# EAGLE design sketchy_060306_produced (EAGLE 4.15)
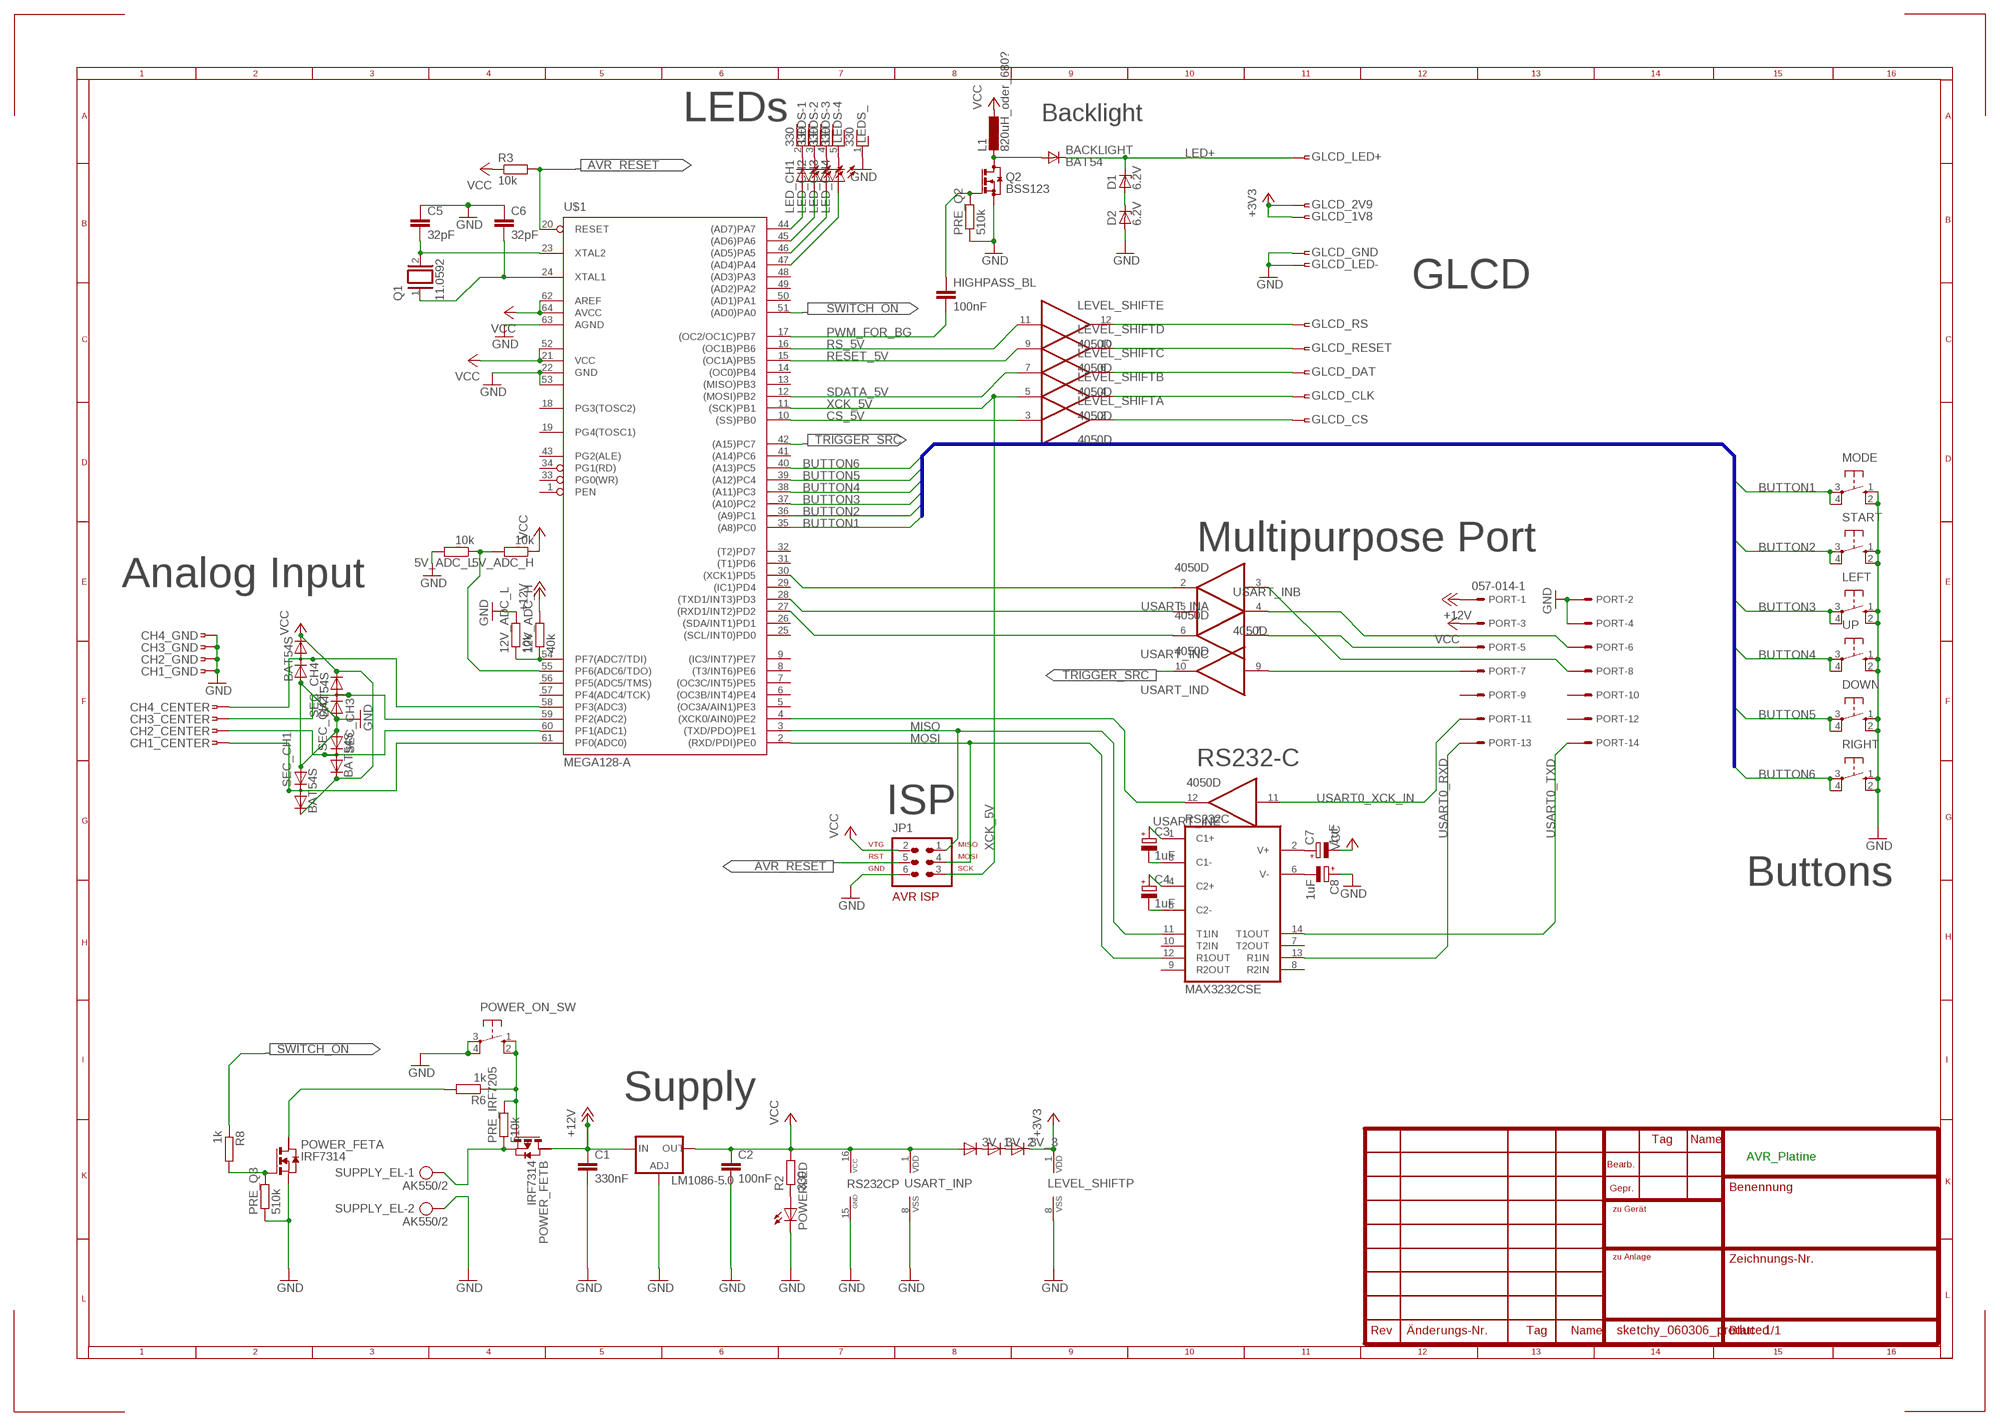
[diagram p0: schematic, sheet 1]

## Parts
3V_1  DIODE-MINIMELF  [MINIMELF]
3V_2  DIODE-MINIMELF  [MINIMELF]
3V_3  DIODE-MINIMELF  [MINIMELF]
5V_ADC_H  10k  R-EU_M0805  [M0805]
5V_ADC_L  10k  R-EU_M0805  [M0805]
12V_ADC_H  40k  R-EU_M0805  [M0805]
12V_ADC_L  10k  R-EU_M0805  [M0805]
BACKLIGHT  BAT54  DSOT23  [SOT-23]
C1  330nF  C-EU050-025X075  [C050-025X075]
C2  100nF  C-EU050-025X075  [C050-025X075]
C3  1uF  CPOL-EU153CLV-0405  [153CLV-0405]
C4  1uF  CPOL-EU153CLV-0405  [153CLV-0405]
C5  32pF  C-EUC0805  [C0805]
C6  32pF  C-EUC0805  [C0805]
C7  1uF  CPOL-EU153CLV-0405  [153CLV-0405]
C8  1uF  CPOL-EU153CLV-0405  [153CLV-0405]
CH1  BNC_GEWINKELT  [BNC]
CH2  BNC_GEWINKELT  [BNC]
CH3  BNC_GEWINKELT  [BNC]
CH4  BNC_GEWINKELT  [BNC]
D1  6.2V  ZENER-DIODESOT23  [SOT23]
D2  6.2V  ZENER-DIODESOT23  [SOT23]
DOWN  10-XX  [B3F-10XX]
GLCD  GLCD_S65  [GLCD_S65]
HIGHPASS_BL  100nF  C-EU050-025X075  [C050-025X075]
JP1  AVR-ISP-6  [AVR-ISP-6]
L1  820uH_oder_680?  L-EU2200-12.7  [2200-12.7]
LED_CH1  LEDCHIPLED_0805  [CHIPLED_0805]
LED_CH2  LEDCHIPLED_0805  [CHIPLED_0805]
LED_CH3  LEDCHIPLED_0805  [CHIPLED_0805]
LED_CH4  LEDCHIPLED_0805  [CHIPLED_0805]
LEDS  330  RNX4  [RN-5]
LEFT  10-XX  [B3F-10XX]
LEVEL_SHIFT  4050D  [SO16]
LM1086-5.0  LM317TL  [317TL]
MODE  10-XX  [B3F-10XX]
PORT  057-014-1  [057-014-1]
POWER_FET  IRF7314  PN_MOSFET-SO8  [SO8]
POWER_ON_SW  10-XX  [B3F-10XX]
POWERLED  LEDCHIPLED_0805  [CHIPLED_0805]
PRE_IRF7205  510k  R-EU_M0805  [M0805]
PRE_Q2  510k  R-EU_M0805  [M0805]
PRE_Q3  510k  R-EU_M0805  [M0805]
Q1  11.0592  XTAL/S  [QS]
Q2  BSS123  [SOT23]
R2  330  R-EU_M0805  [M0805]
R3  10k  R-EU_M0805  [M0805]
R6  1k  R-EU_M0805  [M0805]
R8  1k  R-EU_M0805  [M0805]
RIGHT  10-XX  [B3F-10XX]
RS232C  MAX3232CSE  [SO16]
SEC_CH1  BAT54S  DIODE_2CACA-SOT23  [SOT23]
SEC_CH2  BAT54S  DIODE_2CACA-SOT23  [SOT23]
SEC_CH3  BAT54S  DIODE_2CACA-SOT23  [SOT23]
SEC_CH4  BAT54S  DIODE_2CACA-SOT23  [SOT23]
START  10-XX  [B3F-10XX]
SUPPLY_EL  AK550/2  [AK550/2]
U$1  MEGA128-A  [TQFP64]
UP  10-XX  [B3F-10XX]
USART_IN  4050D  [SO16]

## Nets
+3V3: 3V_3.C GLCD.6 GLCD.8 LEVEL_SHIFT.1(P:VDD)
+12V: 12V_ADC_H.2 C1.1 LM1086-5.0.3(IN) PORT.1 POWER_FET.5(B:D)
AVR_RESET: JP1.5 R3.2 U$1.20(RESET)
BUTTON1: MODE.3(P) MODE.4(P1) U$1.35((A8)PC0)
BUTTON2: START.3(P) START.4(P1) U$1.36((A9)PC1)
BUTTON3: LEFT.3(P) LEFT.4(P1) U$1.37((A10)PC2)
BUTTON4: U$1.38((A11)PC3) UP.3(P) UP.4(P1)
BUTTON5: DOWN.3(P) DOWN.4(P1) U$1.39((A12)PC4)
BUTTON6: RIGHT.3(P) RIGHT.4(P1) U$1.40((A13)PC5)
CS_5V: LEVEL_SHIFT.3(A:I) U$1.10((SS)PB0)
GND: 5V_ADC_L.2 12V_ADC_L.2 C1.2 C2.2 C5.1 C6.1 C8.+ CH1.GND CH2.GND CH3.GND CH4.GND D2.1(A) DOWN.1(S) DOWN.2(S1) GLCD.7 GLCD.10 JP1.6 LEDS.1 LEFT.1(S) LEFT.2(S1) LEVEL_SHIFT.8(P:VSS) LM1086-5.0.1(ADJ) MODE.1(S) MODE.2(S1) PORT.2 PORT.4 POWER_FET.1(A:S) POWER_ON_SW.3(P) POWER_ON_SW.4(P1) POWERLED.C PRE_Q2.1 PRE_Q3.1 Q2.2(S) RIGHT.1(S) RIGHT.2(S1) RS232C.15(GND) SEC_CH1.1(A) SEC_CH2.1(A) SEC_CH3.1(A) SEC_CH4.1(A) START.1(S) START.2(S1) SUPPLY_EL.2 U$1.22(GND) U$1.53(GND1) U$1.63(AGND) UP.1(S) UP.2(S1) USART_IN.8(P:VSS)
LED+: BACKLIGHT.1(C) D1.3(C) GLCD.9
MISO: JP1.1 RS232C.11(T1IN) U$1.3((TXD/PDO)PE1)
MOSI: JP1.4 RS232C.12(R1OUT) U$1.2((RXD/PDI)PE0)
N$2: 12V_ADC_H.1 12V_ADC_L.1 U$1.54(PF7(ADC7/TDI))
N$3: BACKLIGHT.3(A) L1.2 Q2.3(D)
N$4: POWERLED.A R2.1
N$5: D1.1(A) D2.3(C)
N$6: 3V_1.C 3V_2.A
N$7: 3V_2.C 3V_3.A
N$8: POWER_FET.2(A:G) PRE_Q3.2 R8.2
N$9: POWER_FET.4(B:G) POWER_ON_SW.1(S) POWER_ON_SW.2(S1) PRE_IRF7205.2 R6.1
N$10: C5.2 Q1.2 U$1.23(XTAL2)
N$11: C6.2 Q1.1 U$1.24(XTAL1)
N$12: POWER_FET.7(A:D) R6.2
N$13: U$1.30((XCK1)PD5) USART_IN.2(A:O)
N$15: POWER_FET.3(B:S) PRE_IRF7205.1 SUPPLY_EL.1
N$16: U$1.28((TXD1/INT3)PD3) USART_IN.5(B:I)
N$17: U$1.27((RXD1/INT2)PD2) USART_IN.6(C:O)
N$18: GLCD.1 LEVEL_SHIFT.12(E:O)
N$19: GLCD.2 LEVEL_SHIFT.10(D:O)
N$20: GLCD.3 LEVEL_SHIFT.2(A:O)
N$21: GLCD.4 LEVEL_SHIFT.4(B:O)
N$23: GLCD.5 LEVEL_SHIFT.6(C:O)
N$26: CH1.CENTER SEC_CH1.3(AC) U$1.61(PF0(ADC0))
N$27: CH2.CENTER SEC_CH2.3(AC) U$1.60(PF1(ADC1))
N$28: CH3.CENTER SEC_CH3.3(AC) U$1.59(PF2(ADC2))
N$29: CH4.CENTER SEC_CH4.3(AC) U$1.58(PF3(ADC3))
N$30: PORT.6 USART_IN.4(B:O)
N$32: PORT.5 USART_IN.7(C:I)
N$34: PORT.8 USART_IN.3(A:I)
N$35: PORT.7 USART_IN.9(D:I)
N$36: 5V_ADC_H.2 5V_ADC_L.1 U$1.55(PF6(ADC6/TDO))
N$37: LED_CH1.A U$1.44((AD7)PA7)
N$38: LED_CH2.A U$1.45((AD6)PA6)
N$39: LED_CH3.A U$1.46((AD5)PA5)
N$40: LED_CH4.A U$1.47((AD4)PA4)
N$41: LED_CH1.C LEDS.2
N$42: LED_CH2.C LEDS.3
N$43: LED_CH3.C LEDS.4
N$44: LED_CH4.C LEDS.5
N$45: C3.+ RS232C.1(C1+)
N$46: C3.- RS232C.3(C1-)
N$47: C4.+ RS232C.4(C2+)
N$48: C4.- RS232C.5(C2-)
N$49: C7.+ RS232C.2(V+)
N$50: C8.- RS232C.6(V-)
N$51: HIGHPASS_BL.1 PRE_Q2.2 Q2.1(G)
N$54: U$1.4((XCK0/AIN0)PE2) USART_IN.12(E:O)
PWM_FOR_BG: HIGHPASS_BL.2 U$1.17((OC2/OC1C)PB7)
RESET_5V: LEVEL_SHIFT.9(D:I) U$1.15((OC1A)PB5)
RS_5V: LEVEL_SHIFT.11(E:I) U$1.16((OC1B)PB6)
SDATA_5V: LEVEL_SHIFT.7(C:I) U$1.12((MOSI)PB2)
SWITCH_ON: R8.1 U$1.51((AD0)PA0)
TRIGGER_SRC: U$1.42((A15)PC7) USART_IN.10(D:O)
USART0_RXD: PORT.13 RS232C.13(R1IN)
USART0_TXD: PORT.14 RS232C.14(T1OUT)
USART0_XCK_IN: PORT.11 USART_IN.11(E:I)
VCC: 3V_1.A 5V_ADC_H.1 C2.1 C7.- JP1.2 L1.1 LM1086-5.0.2(OUT) PORT.3 R2.2 R3.1 RS232C.16(VCC) SEC_CH1.2(C) SEC_CH2.2(C) SEC_CH3.2(C) SEC_CH4.2(C) U$1.21(VCC) U$1.52(VCC1) U$1.62(AREF) U$1.64(AVCC) USART_IN.1(P:VDD)
XCK_5V: JP1.3 LEVEL_SHIFT.5(B:I) U$1.11((SCK)PB1)
Unconnected: LEVEL_SHIFT.14(F:I) LEVEL_SHIFT.15(F:O) PORT.9 PORT.10 PORT.12 POWER_FET.6(B:D2) POWER_FET.8(A:D2) RS232C.7(T2OUT) RS232C.8(R2IN) RS232C.9(R2OUT) RS232C.10(T2IN) U$1.1(PEN) U$1.5((OC3A/AIN1)PE3) U$1.6((OC3B/INT4)PE4) U$1.7((OC3C/INT5)PE5) U$1.8((T3/INT6)PE6) U$1.9((IC3/INT7)PE7) U$1.13((MISO)PB3) U$1.14((OC0)PB4) U$1.18(PG3(TOSC2)) U$1.19(PG4(TOSC1)) U$1.25((SCL/INT0)PD0) U$1.26((SDA/INT1)PD1) U$1.29((IC1)PD4) U$1.31((T1)PD6) U$1.32((T2)PD7) U$1.33(PG0(WR)) U$1.34(PG1(RD)) U$1.41((A14)PC6) U$1.43(PG2(ALE)) U$1.48((AD3)PA3) U$1.49((AD2)PA2) U$1.50((AD1)PA1) U$1.56(PF5(ADC5/TMS)) U$1.57(PF4(ADC4/TCK)) USART_IN.14(F:I) USART_IN.15(F:O)

## Buses
BUTTON[1..6]

## Notes on the sheet
- LEDs | Backlight
- GLCD
- Multipurpose Port
- Analog Input
- RS232-C
- ISP
- Buttons
- Supply
- AVR_Platine

## Library data of the parts
3V_1-3V_3 = diode:DIODE-: DIODE
5V_ADC_H 5V_ADC_L 12V_ADC_H 12V_ADC_L PRE_IRF7205 PRE_Q2 PRE_Q3 R2 R3 R6 R8 = rcl:R-EU_: RESISTOR, European symbol
BACKLIGHT = zetex:D: DIODE
C1 C2 C5 C6 HIGHPASS_BL = rcl:C-EU: CAPACITOR, European symbol
C3 C4 C7 C8 = rcl:CPOL-EU: POLARIZED CAPACITOR, European symbol
CH1-CH4 = zween:BNC_GEWINKELT
D1 D2 = diode:ZENER-DIODE: Z-Diode
DOWN LEFT MODE POWER_ON_SW RIGHT START UP = switch-omron:10-XX: OMRON SWITCH
GLCD = zween:GLCD_S65: package for GLCD from Siemens S65
JP1 = atmel:AVR-ISP-6: AVR ISP-6 Serial Programming Header
L1 = rcl:L-EU: INDUCTOR, European symbol
LED_CH1-LED_CH4 POWERLED = led:LED: LED OSRAM: - CHIPLED LG R971, LG N971, LY N971, LG Q971, LY Q971, LO R971, LY R971 LH N974, LH R974 LS Q976, LO Q976, LY Q976 LO Q996 - Hyper CHIPLED LW Q18S LB Q993, LB Q99A, LB R99A - SideLED LS A670, LO A670, LY A670, LG A670, LP A670 LB A673, LV A673, LT A673, LW A673 LH A674 LY A675 LS A676, LA A676, LO A676, LY A676, LW A676 LS A679, LY A679, LG A679 - Hyper Micro SIDELED® LS Y876, LA Y876, LO Y876, LY Y876 LT Y87S - SmartLED LW L88C, LW L88S LB L89C, LB L89S, LG L890 LS L89K, LO L89K, LY L89K LS L896, LA L896, LO L896, LY L896 - TOPLED LS T670, LO T670, LY T670, LG T670, LP T670 LSG T670, LSP T670, LSY T670, LOP T670, LYG T670 LG T671, LOG T671, LSG T671 LB T673, LV T673, LT T673, LW T673 LH T674 LS T676, LA T676, LO T676, LY T676, LB T676, LH T676, LSB T676, LW T676 LB T67C, LV T67C, LT T67C, LS T67K, LO T67K, LY T67K, LW E67C LS E67B, LA E67B, LO E67B, LY E67B, LB E67C, LV E67C, LT E67C LW T67C LS T679, LY T679, LG T679 LS T770, LO T770, LY T770, LG T770, LP T770 LB T773, LV T773, LT T773, LW T773 LH T774 LS E675, LA E675, LY E675, LS T675 LS T776, LA T776, LO T776, LY T776, LB T776 LHGB T686 LT T68C, LB T68C - Hyper Mini TOPLED® LB M676 - Mini TOPLED Santana® LG M470 LS M47K, LO M47K, LY M47K Source: http://www.osram.convergy.de/
LEDS = resistor-net:RNX4: RESISTOR NETWORK
LEVEL_SHIFT USART_IN = 40xx:4050: Hex non-inverting BUFFER
LM1086-5.0 = v-reg:LM317TL: VOLTAGE REGULATOR
PORT = con-panduit:057-014-: CONNECTOR 10-pin series 057 contact pc board low profile headers
POWER_FET = zetex:PN_MOSFET-: DUAL N AND P-CHANNEL ENHANCEMENT MODE MOSFET source ZXMD63C02.pdf from http://www.zetex.com/
Q1 = special:XTAL/S: CRYSTAL
Q2 = transistor-small-signal:BSS123: N-CHANNEL MOS FET
RS232C = maxim:MAX3232*: True RS-232 Transceivers 3.0V to 5.5V, Low-Power up to 1Mbps, Using Four 0.1µF External Capacitors Source: http://pdfserv.maxim-ic.com/en/ds/MAX3222-MAX3241.pdf
SEC_CH1-SEC_CH4 = diode:DIODE_2CACA-: 2 Diodes - Cathode-Anode|Cathode-Anode
SUPPLY_EL = con-ptr500:AK550/2: CONNECTOR
U$1 = avr:MEGA128: MICROCONTROLLER 128 Kbytes FLASH 4 Kbytes SRAM 4 Kbytes EEPROM DUAL USART 8-channel 10 bit ADC

## Net classes
1 motorsupply: width 1.016 mm, drill 1.016 mm

## Board
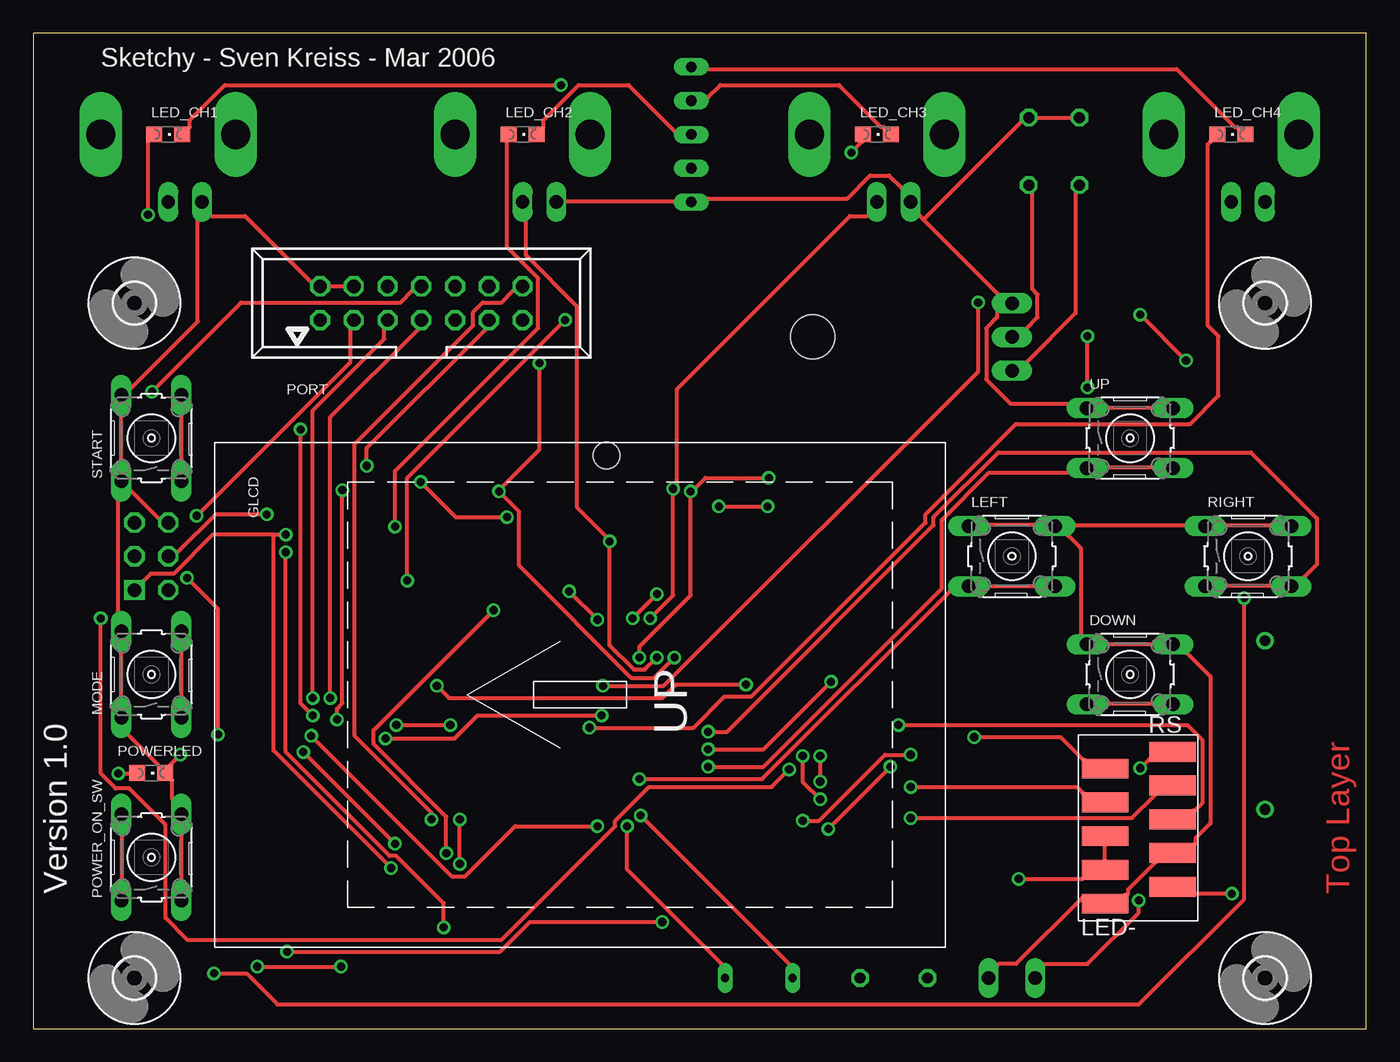
[diagram p1: board, top side]
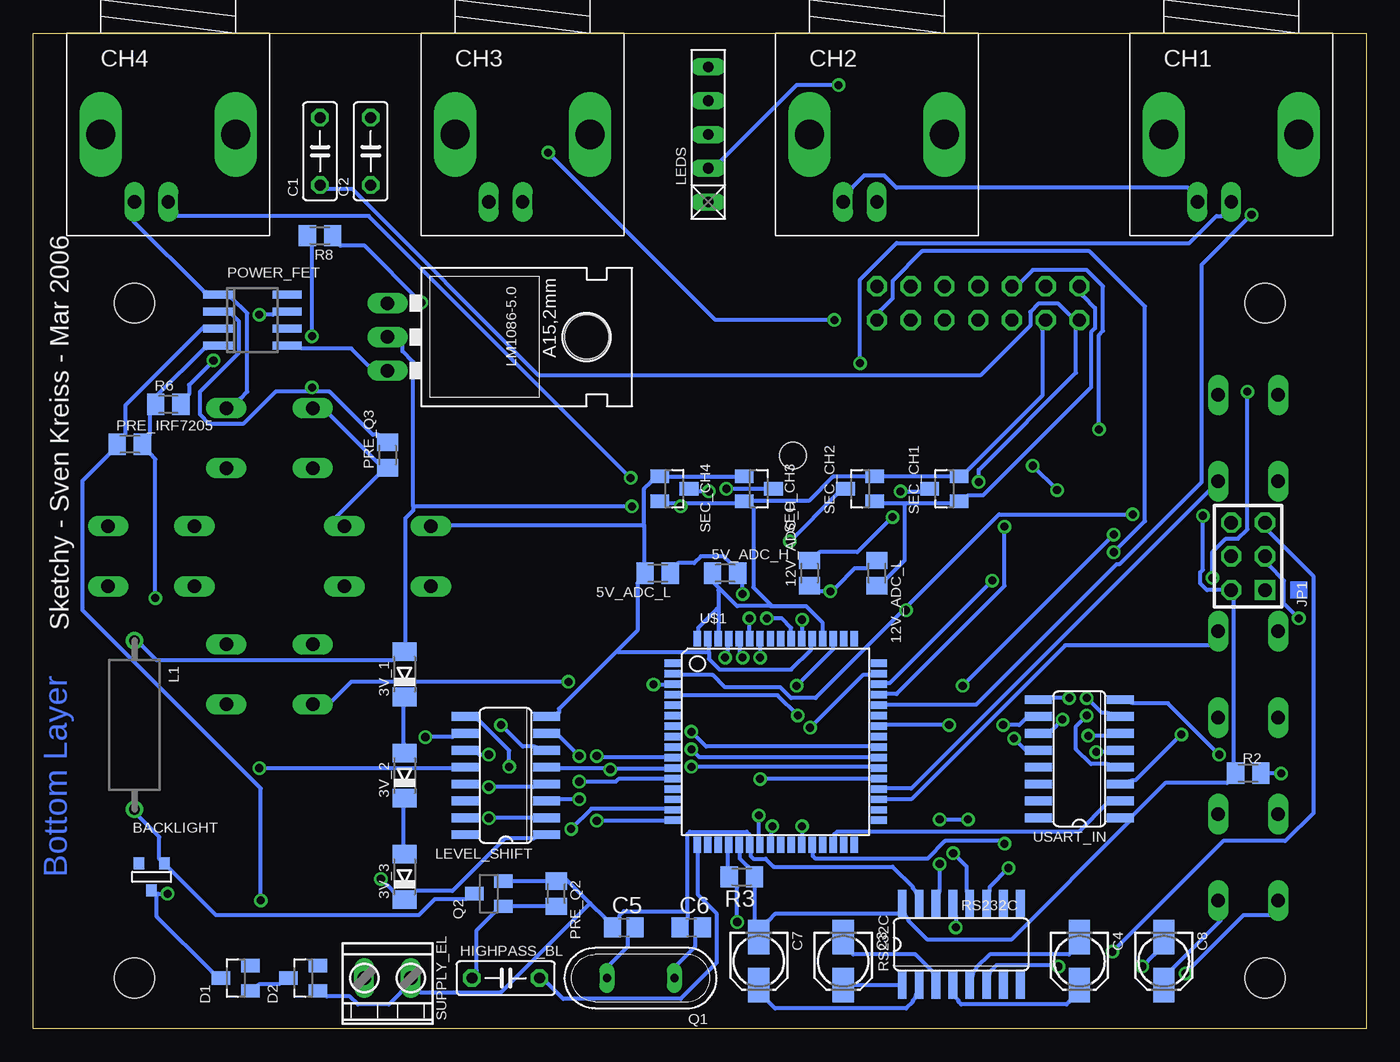
[diagram p2: board, bottom side, seen from below]

Size 100.33 x 74.93 mm. Coordinates in mm from the lower left corner, seen from the top.
Outline: 0,0 100.33,0 100.33,74.93 0,74.93 0,0
Copper layers (1*16): Top 0.035mm / dielectric 1.5mm / Bottom 0.035mm
Design rules "default": minimum track width 12mil, minimum drill 24mil, track to track 10mil, track to pad 10mil, pad to pad 8mil, via to via 10mil, smd to smd 8mil, copper to edge 40mil, drill to drill 10mil, minimum pad ring 10mil, minimum via ring 8mil, stop-mask expansion 4mil, vias tented up to drill 0mil, thermal gap 10mil

### Footprints (pad centres in the part's own frame; a part is rotated, then mirrored left to right if it is on the bottom)
MINIMELF = smd 1.4 x 1.8: A 1.7,0; C -1.7,0
M0805 = smd 1.3 x 1.6: 1 -0.95,0; 2 0.95,0
SOT-23 = smd 0.787 x 0.889: 1 0.025,-1.016; 2 -0.94,1.016; 3 0.991,1.016
C050-025X075 = drill 0.813 octagon: 1 -2.54,0; 2 2.54,0
153CLV-0405 = smd 2.6 x 1.6: + 1.8,0; - -1.8,0
C0805 = smd 1.3 x 1.5: 1 -0.85,0; 2 0.85,0
BNC = drill 1 long: CENTER 0,-5.08; GND -2.54,-5.08 | drill 2.2 long: P$1 -5.08,0; P$4 5.08,0
SOT23 = smd 1 x 1.4: 1 -0.95,-1.1; 2 0.95,-1.1; 3 0,1.1
B3F-10XX = drill 1.016 long: 1 -3.251,2.261; 2 3.251,2.261; 3 -3.251,-2.261; 4 3.251,-2.261
GLCD_S65 = smd 1.5 x 3.5: 1 3.285,12.08; 2 4.555,7; 3 5.825,12.08; 4 7.095,7; 5 8.365,12.08; 6 9.635,7; 7 10.905,12.08; 8 12.175,7; 9 13.445,12.08; 10 14.715,7 | hole 2: -19,-30.5
AVR-ISP-6 = drill 1.016 square: 1 -2.54,-1.27 | drill 1.016 octagon: 2 -2.54,1.27; 3 0,-1.27; 4 0,1.27; 5 2.54,-1.27; 6 2.54,1.27
2200-12.7 = drill 0.8 pad 1.27 round: 1 -6.35,0; 2 6.35,0
CHIPLED_0805 = smd 1.2 x 1.2: A 0,-1.05; C 0,1.05
RN-5 = drill 0.813 long: 1 -5.08,0; 2 -2.54,0; 3 0,0; 4 2.54,0; 5 5.08,0
SO16 = smd 0.66 x 2.032: 1 -4.445,-3.073; 2 -3.175,-3.073; 3 -1.905,-3.073; 4 -0.635,-3.073; 5 0.635,-3.073; 6 1.905,-3.073; 7 3.175,-3.073; 8 4.445,-3.073; 9 4.445,3.073; 10 3.175,3.073; 11 1.905,3.073; 12 0.635,3.073; 13 -0.635,3.073; 14 -1.905,3.073; 15 -3.175,3.073; 16 -4.445,3.073
317TL = drill 1.016 long: 1 -2.54,-3.81; 2 0,-3.81; 3 2.54,-3.81 | hole 3.302: 0,11.176
057-014-1 = drill 1 octagon: 1 -7.62,-1.27; 2 -7.62,1.27; 3 -5.08,-1.27; 4 -5.08,1.27; 5 -2.54,-1.27; 6 -2.54,1.27; 7 0,-1.27; 8 0,1.27; 9 2.54,-1.27; 10 2.54,1.27; 11 5.08,-1.27; 12 5.08,1.27; 13 7.62,-1.27; 14 7.62,1.27
SO8 = smd 0.6 x 2.2: 1 -1.905,-2.6; 2 -0.635,-2.6; 3 0.635,-2.6; 4 1.905,-2.6; 5 1.905,2.6; 6 0.635,2.6; 7 -0.635,2.6; 8 -1.905,2.6
QS = drill 0.61 long: 1 -2.54,0; 2 2.54,0
AK550/2 = drill 1 pad 1.5 long: 1 -1.75,0; 2 1.75,0
TQFP64 = smd 1.194 x 0.559: 1 -7.76,5.905; 2 -7.76,5.118; 3 -7.76,4.331; 4 -7.76,3.543; 5 -7.76,2.756; 6 -7.76,1.968; 7 -7.76,1.181; 8 -7.76,0.394; 9 -7.76,-0.394; 10 -7.76,-1.181; 11 -7.76,-1.968; 12 -7.76,-2.756; 13 -7.76,-3.543; 14 -7.76,-4.331; 15 -7.76,-5.118; 16 -7.76,-5.905; 33 7.76,-5.905; 34 7.76,-5.118; 35 7.76,-4.331; 36 7.76,-3.543; 37 7.76,-2.756; 38 7.76,-1.968; 39 7.76,-1.181; 40 7.76,-0.394; 41 7.76,0.394; 42 7.76,1.181; 43 7.76,1.968; 44 7.76,2.756; 45 7.76,3.543; 46 7.76,4.331; 47 7.76,5.118; 48 7.76,5.905 | smd 0.559 x 1.194: 17 -5.905,-7.76; 18 -5.118,-7.76; 19 -4.331,-7.76; 20 -3.543,-7.76; 21 -2.756,-7.76; 22 -1.968,-7.76; 23 -1.181,-7.76; 24 -0.394,-7.76; 25 0.394,-7.76; 26 1.181,-7.76; 27 1.968,-7.76; 28 2.756,-7.76; 29 3.543,-7.76; 30 4.331,-7.76; 31 5.118,-7.76; 32 5.905,-7.76; 49 5.905,7.76; 50 5.118,7.76; 51 4.331,7.76; 52 3.543,7.76; 53 2.756,7.76; 54 1.968,7.76; 55 1.181,7.76; 56 0.394,7.76; 57 -0.394,7.76; 58 -1.181,7.76; 59 -1.968,7.76; 60 -2.756,7.76; 61 -3.543,7.76; 62 -4.331,7.76; 63 -5.118,7.76; 64 -5.905,7.76
3,0 = hole 3: 0,0

### Placement (x,y rotation side)
3V_1  72.39,26.67 90 bottom
3V_2  72.39,19.05 90 bottom
3V_3  72.39,11.43 90 bottom
5V_ADC_H  48.26,34.29 0 bottom
5V_ADC_L  53.34,34.29 180 bottom
12V_ADC_H  41.91,34.29 90 bottom
12V_ADC_L  36.83,34.29 270 bottom
BACKLIGHT  91.44,11.43 0 bottom
C1  78.74,66.04 90 bottom
C2  74.93,66.04 90 bottom
C3  39.37,5.08 270 bottom
C4  21.59,5.08 270 bottom
C5  55.88,7.62 0 bottom
C6  50.8,7.62 0 bottom
C7  45.72,5.08 270 bottom
C8  15.24,5.08 270 bottom
CH1  10.16,67.31 0 bottom
CH2  36.83,67.31 0 bottom
CH3  63.5,67.31 0 bottom
CH4  90.17,67.31 0 bottom
D1  85.09,3.81 90 bottom
D2  80.01,3.81 90 bottom
DOWN  82.55,26.67 0 top
GLCD  73.66,24.13 270 top
HIGHPASS_BL  64.77,3.81 0 bottom
JP1  8.89,35.56 90 bottom
L1  92.71,22.86 270 bottom
LED_CH1  10.16,67.31 270 top
LED_CH2  36.83,67.31 270 top
LED_CH3  63.5,67.31 270 top
LED_CH4  90.17,67.31 270 top
LEDS  49.53,67.31 90 bottom
LEFT  73.66,35.56 0 top
LEVEL_SHIFT  64.77,19.05 90 bottom
LM1086-5.0  69.85,52.07 270 bottom
MODE  8.89,26.67 90 top
PORT  29.21,54.61 0 top
POWER_FET  83.82,53.34 270 bottom
POWER_ON_SW  8.89,12.89 90 top
POWERLED  8.89,19.24 270 top
PRE_IRF7205  93.06,43.99 0 bottom
PRE_Q2  60.96,10.16 270 bottom
PRE_Q3  73.66,43.18 90 bottom
Q1  54.61,3.81 180 bottom
Q2  66.04,10.16 90 bottom
R2  8.89,19.24 180 bottom
R3  46.99,11.43 180 bottom
R6  90.17,46.99 0 bottom
R8  78.74,59.69 180 bottom
RIGHT  91.44,35.56 0 top
RS232C  30.48,6.35 0 bottom
SEC_CH1  31.75,40.64 90 bottom
SEC_CH2  38.1,40.64 90 bottom
SEC_CH3  45.72,40.64 270 bottom
SEC_CH4  52.07,40.64 270 bottom
START  8.89,44.45 90 top
SUPPLY_EL  73.66,3.81 0 bottom
U$1  44.45,21.59 0 bottom
U$3  [3,0]  7.62,54.61 0 top
U$4  [3,0]  92.71,54.61 0 top
U$5  [3,0]  92.71,3.81 0 top
U$6  [3,0]  7.62,3.81 0 top
UP  82.55,44.45 0 top
USART_IN  21.59,20.32 90 bottom

### Tracks (layer width: path | path; a pad name or v marks a point on that pad's centre or on a via)
+3V3  (via drill 0.61)
  Top 0.305: GLCD.6 80.67,13.82 80.67,12.7 GLCD.8 78.94,11.28 v74.17,11.28
  Bottom 0.305: LEVEL_SHIFT.1 62.69,14.33 64.82,14.33 68.78,10.36 71.53,10.36 3V_3.C 73.25,10.36 v74.17,11.28
+12V  (via drill 0.61)
  Top 0.305: C1.1 78.44,62.89 78.44,53.85 74.78,50.19 LM1086-5.0.3 | v35.66,38.51 31.8,38.51 v29.16,41.15
  Bottom 0.305: POWER_FET.5 80.16,51.21 76.4,51.21 75.08,49.89 LM1086-5.0.3 | v35.66,38.51 38.3,35.87 41.15,35.87 12V_ADC_H.2 | v29.16,41.15 29.16,42.06 21.84,49.38 21.84,52.63 PORT.1 22.25,53.65 23.16,54.56 24.69,54.56 25.3,53.95 25.3,52.93 29.06,49.17 62.28,49.17 76.3,63.2 78.13,63.2 C1.1
AVR_RESET  (via drill 0.61)
  Top 0.305: v47.35,8.03 37.39,8.03 35.15,5.79 v19.1,5.79
  Bottom 0.305: U$1.20 48.06,13.31 48.06,12.19 R3.2 47.35,10.67 v47.35,8.03 | v19.1,5.79 10.77,14.12 6.1,14.12 3.96,16.26 3.96,34.04 7.32,37.39 JP1.5
BUTTON1
  Top 0.305: MODE.3 11.18,24.89 11.18,28.45 MODE.4
  Bottom 0.305: U$1.35 36.17,17.27 34.24,17.27 22.66,28.85 11.89,28.85 MODE.4
BUTTON2
  Top 0.305: START.4 11.18,46.23 11.18,42.67 START.3
  Bottom 0.305: U$1.36 36.17,18.09 34.24,18.09 11.89,40.44 START.3
BUTTON3  (via drill 0.61)
  Top 0.305: v45.62,18.8 54.86,18.8 68.99,32.92 LEFT.3 71.83,33.33 75.49,33.33 LEFT.4
  Bottom 0.305: v45.62,18.8 37.19,18.8 U$1.37
BUTTON4  (via drill 0.61)
  Top 0.305: v50.8,19.71 54.97,19.71 68.38,33.12 68.38,38.3 71.93,41.86 77.83,41.86 UP.3 80.77,42.27 84.33,42.27 UP.4
  Bottom 0.305: v50.8,19.71 37.19,19.71 U$1.38
BUTTON5  (via drill 0.61)
  Top 0.305: v50.8,21.03 54.97,21.03 v60.05,26.11 | DOWN.4 84.33,24.49 80.77,24.49 DOWN.3
  Bottom 0.305: v50.8,21.03 50.19,20.42 37.19,20.42 U$1.39 | v60.05,26.11 76.4,26.11 77.83,24.69 DOWN.3
BUTTON6  (via drill 0.61)
  Top 0.305: v50.8,22.35 52.22,22.35 67.77,37.9 67.77,38.51 72.64,43.38 91.64,43.38 96.62,38.41 96.62,34.95 95.71,34.04 RIGHT.4 93.27,33.33 89.61,33.33 RIGHT.3
  Bottom 0.305: v50.8,22.35 49.68,21.23 37.19,21.23 U$1.40
CS_5V  (via drill 0.61)
  Top 0.305: v57.91,20.52 57.91,18.59 v59.23,17.27
  Bottom 0.305: v57.91,20.52 57.81,20.42 52.73,20.42 U$1.10 | v59.23,17.27 60.76,17.27 LEVEL_SHIFT.3
GND  (via drill 0.61)
  Top 0.305: PORT.4 PORT.2 20.93,56.19 15.95,61.16 13.41,61.16 CH1.GND 12.39,60.76 12.39,53.24 7.32,48.16 START.2 6.6,46.23 6.6,42.67 START.1 | JP1.6 9.45,38.41 7.32,40.54 START.1 | POWERLED.C 10.46,18.69 10.46,17.27 POWER_ON_SW.4 11.18,14.63 11.18,11.07 POWER_ON_SW.3 | v11.07,20.62 10.26,19.81 POWERLED.C | POWERLED.C 9.45,19.81 7.11,22.15 MODE.1 6.6,24.89 6.6,28.45 MODE.2 6.4,31.39 6.4,39.73 START.1 | SUPPLY_EL.2 72.64,4.88 73.97,4.88 78.94,9.86 GLCD.10 82.4,10.16 82.4,10.46 84.43,12.5 GLCD.7 87.48,13.92 87.48,14.33 88.59,15.44 88.59,26.52 86.87,28.25 DOWN.2 84.33,28.96 80.77,28.96 DOWN.1 78.84,29.67 78.84,36.17 77.93,37.08 LEFT.2 | CH2.GND 40.03,62.28 48.26,62.28 LEDS.1 50.8,62.48 61.27,62.48 62.99,64.21 64.41,64.21 65.33,63.3 CH3.GND 66.75,61.16 67,60.91 | C1.2 C2.2 74.37,68.28 67,60.91 | 67,60.91 72.64,55.27 LM1086-5.0.1 72.54,53.95 72.54,53.54 71.73,52.73 71.73,48.87 73.56,47.04 77.83,47.04 UP.1 80.77,46.74 84.33,46.74 UP.2 | RIGHT.2 93.27,37.9 89.61,37.9 RIGHT.1 86.77,37.9 78.33,37.9 LEFT.2 | LEFT.1 71.83,37.9 75.49,37.9 LEFT.2
  Bottom 0.305: 34.75,39.52 36.37,39.52 SEC_CH2.1 | 34.75,39.52 31.29,39.52 SEC_CH1.1 29.97,40.13 28.85,40.13 20.73,48.26 20.73,52.43 20.42,52.73 20.42,54.25 21.34,55.17 PORT.2 | 12V_ADC_L.2 36.07,33.93 34.75,35.26 34.75,39.52 | C8.+ 14.53,4.57 10.97,8.13 POWER_ON_SW.3 | v11.07,20.62 14.94,24.49 17.58,24.49 USART_IN.8 | D2.1 78.23,2.44 76.5,2.44 75.89,1.83 73.56,1.83 72.64,2.74 SUPPLY_EL.2 71.22,2.74 65.13,2.74 58.42,9.45 | Q2.2 64.31,11.07 61.67,11.07 PRE_Q2.1 60.25,11.28 58.42,9.45 | 58.42,9.45 57.3,8.33 C5.1 56.19,8.33 56.19,8.53 55.88,8.84 51.1,8.84 | 51.1,8.84 51.1,8.33 C6.1 | 51.1,8.84 51.1,14.63 50.9,14.83 46.63,14.83 46.43,14.63 46.43,14.33 U$1.22 46.33,13.31 46.33,13.01 46.13,12.8 45.21,12.8 44.6,12.19 35.66,12.19 34.14,10.67 34.14,10.57 33.93,10.36 RS232C.15 | 49.48,28.35 49.48,28.85 U$1.63 | 49.48,28.35 49.48,27.84 48.67,27.03 43.28,27.03 41.76,28.55 41.76,28.85 U$1.53 | SEC_CH3.1 47.45,41.55 52.53,41.55 SEC_CH4.1 53.85,41.15 54.36,40.64 54.36,37.9 | 54.36,37.9 54.36,35.05 5V_ADC_L.2 54.86,33.53 54.86,29.97 56.39,28.45 | 56.39,28.45 60.76,24.08 60.76,23.77 LEVEL_SHIFT.8 | 49.48,28.35 56.29,28.35 56.39,28.45 | CH4.GND 92.76,60.76 87.48,55.47 POWER_FET.1 85.34,54.97 84.23,53.85 84.23,47.95 84.73,47.45 UP.2 | LEFT.2 77.52,38.51 74.37,41.66 PRE_Q3.1 74.37,42.57 78.03,46.23 UP.1 | 54.36,37.9 68.99,37.9 LEFT.1 | CH1.GND 13.41,63.3 35.36,63.3 36.27,64.21 37.8,64.21 38.71,63.3 CH2.GND
LED+  (via drill 0.61)
  Top 0.305: v90.22,10.16 87.48,10.16 GLCD.9
  Bottom 0.305: 91.03,10.06 91.03,8.43 86.87,4.27 D1.3 | 91.03,10.06 BACKLIGHT.1 | v90.22,10.16 90.93,10.16 91.03,10.06
MISO  (via drill 0.61)
  Top 0.305: v53.65,25.91 48.36,25.91 47.35,24.89 31.29,24.89 v30.38,25.81 | 18.09,37.19 13.51,37.19 10.57,34.24 8.84,34.24 JP1.1 | 18.09,37.19 v19,37.19 | v26.92,12.09 18.09,20.93 18.09,37.19
  Bottom 0.305: v53.65,25.91 52.73,25.91 U$1.3 | v19,37.19 v30.38,25.81 | v26.92,12.09 28.35,10.67 28.35,10.36 RS232C.11
MOSI  (via drill 0.61)
  Top 0.305: v17.58,38.71 13.72,38.71 10.87,35.87 JP1.4 | v31.09,13.21 31.09,15.95 25.6,21.44 25.6,22.45 v34.65,31.5
  Bottom 0.305: 34.75,31.6 27.64,38.71 v17.58,38.71 | 34.75,31.6 41.45,24.89 43.28,24.89 44.09,25.7 48.26,25.7 49.17,26.62 51.71,26.62 U$1.2 | v31.09,13.21 30.07,12.19 30.07,10.36 RS232C.12 | v34.65,31.5 34.75,31.6
N$2  (via drill 0.61)
  Top 0.305: v40.34,32.92 v42.47,30.79
  Bottom 0.305: v42.47,30.79 42.47,29.87 U$1.54 | 12V_ADC_H.1 41.15,32.92 v40.34,32.92 39.93,33.22 38.51,34.65 37.59,34.65 12V_ADC_L.1
N$3
  Bottom 0.305: L1.2 92.35,15.95 90.83,14.43 90.83,12.8 BACKLIGHT.3 90.12,12.09 86.56,8.53 71.32,8.53 70.1,9.75 67.77,9.75 Q2.3
N$4  (via drill 0.61)
  Top 0.305: v6.4,19.2 7.32,19.2 POWERLED.A
  Bottom 0.305: v6.4,19.2 7.32,19.2 R2.1
N$5
  Bottom 0.305: D2.3 81.79,3.35 83.31,3.35 D1.1
N$6
  Bottom 0.305: 3V_2.A 72.44,21.44 72.44,24.28 3V_1.C
N$7
  Bottom 0.305: 3V_3.A 72.44,13.82 72.44,16.66 3V_2.C
N$8  (via drill 0.61)
  Top 0.305: v79.35,48.26 v79.35,52.12
  Bottom 0.305: 79.35,47.95 82.09,47.95 84.53,45.52 87.07,45.52 87.78,46.23 87.78,47.95 84.84,50.9 84.84,53.24 85.34,53.75 POWER_FET.2 | 79.35,47.95 78.03,47.95 74.78,44.7 74.37,44.7 PRE_Q3.2 | v79.35,52.12 79.35,58.93 R8.2 | 79.35,47.95 v79.35,48.26
N$9  (via drill 0.61)
  Top 0.305: POWER_ON_SW.1 6.71,11.07 6.71,14.63 POWER_ON_SW.2 | v13.61,4.17 16.05,4.17 18.39,1.83 83.21,1.83 91.14,9.75 v91.14,32.41
  Bottom 0.305: POWER_FET.4 87.48,51.21 90.93,47.75 R6.1 91.54,46.23 91.54,44.7 PRE_IRF7205.2 91.54,43.28 91.14,42.88 v91.14,32.41 | v13.61,4.17 9.25,8.53 7.32,8.53 POWER_ON_SW.1
N$10  (via drill 0.61)
  Top 0.305: v45.72,16.05 56.9,4.88 Q1.2
  Bottom 0.305: v45.72,16.05 45.72,14.33 U$1.23 | C5.2 55.58,6.91 55.58,6.2 56.9,4.88 Q1.2
N$11  (via drill 0.61)
  Top 0.305: v44.7,15.24 44.7,11.99 51.82,4.88 Q1.1
  Bottom 0.305: v44.7,15.24 44.81,15.14 44.81,14.33 U$1.24 | C6.2 50.49,6.91 50.49,6.2 51.82,4.88 Q1.1
N$12  (via drill 0.61)
  Top 0.305: v83.31,53.75 v86.77,50.29
  Bottom 0.305: v86.77,50.29 88.59,48.46 88.59,47.75 R6.2 | v83.31,53.75 82.3,53.75 POWER_FET.7
N$13
  Bottom 0.305: U$1.30 40.03,14.33 40.03,14.63 39.83,14.83 21.64,14.83 19.51,16.97 USART_IN.2
N$15  (via drill 0.61)
  Top 0.305: v83.21,9.65 83.21,8.74 79.35,4.88 76.1,4.88 SUPPLY_EL.1
  Bottom 0.305: POWER_FET.3 87.48,52.83 93.37,46.94 93.37,44.7 PRE_IRF7205.1 94.59,43.28 96.62,41.25 96.62,31.5 83.21,18.09 v83.21,9.65
N$16  (via drill 0.61)
  Top 0.305: v20.32,20.83 v27.23,13.92
  Bottom 0.305: v27.23,13.92 27.43,14.12 31.7,14.12 33.02,12.8 41.45,12.8 41.66,13.01 41.66,13.31 U$1.28 | v20.32,20.83 19.51,20.83 USART_IN.5
N$17  (via drill 0.61)
  Top 0.305: v42.47,15.24 36.27,15.24 32.51,11.48 31.5,11.48 v20.93,22.05
  Bottom 0.305: v42.47,15.24 42.47,14.33 U$1.27 | v20.93,22.05 19.51,22.05 USART_IN.6
N$18  (via drill 0.61)
  Top 0.305: v83.31,19.61 84.02,20.32 GLCD.1
  Bottom 0.305: v83.31,19.61 68.78,19.61 LEVEL_SHIFT.12
N$19  (via drill 0.61)
  Top 0.305: v70.81,21.95 77.32,21.95 78.94,20.32 GLCD.2
  Bottom 0.305: v70.81,21.95 68.78,21.95 LEVEL_SHIFT.10
N$20  (via drill 0.61)
  Top 0.305: v66.04,15.85 82.7,15.85 84.43,17.58 GLCD.3
  Bottom 0.305: v66.04,15.85 62.69,15.85 LEVEL_SHIFT.2
N$21  (via drill 0.61)
  Top 0.305: v66.04,18.19 78.54,18.19 78.94,17.78 GLCD.4
  Bottom 0.305: v66.04,18.19 62.69,18.19 LEVEL_SHIFT.4
N$23  (via drill 0.61)
  Top 0.305: v65.13,22.86 86.87,22.86 87.99,21.74 87.99,16.97 87.48,16.46 GLCD.5
  Bottom 0.305: v65.13,22.86 63.5,21.23 62.69,21.23 LEVEL_SHIFT.6
N$26  (via drill 0.61)
  Top 0.305: v48.26,27.94 46.74,26.42 45.01,26.42 36.58,34.85 36.58,38.91 v35.05,40.44 35.36,40.84 38.1,43.59 v38.1,50.09
  Bottom 0.305: v48.26,27.94 48.06,28.14 48.06,28.85 U$1.61 | v35.05,40.44 33.53,40.44 SEC_CH1.3 | v38.1,50.09 38.1,56.39 35.36,59.13 13.31,59.13 11.28,61.16 10.87,61.16 CH1.CENTER
N$27  (via drill 0.61)
  Top 0.305: v46.94,27.94 46.02,27.03 45.21,27.03 43.38,28.85 v43.38,36.68 43.08,37.08 40.95,39.22 40.95,54.36 37.08,58.22 37.08,60.76 CH2.CENTER
  Bottom 0.305: v46.94,27.94 47.14,28.14 47.14,28.85 U$1.60 | v43.38,36.68 39.83,40.23 SEC_CH2.3
N$28  (via drill 0.61)
  Top 0.305: v46.43,30.89 48.16,32.61 v48.16,40.64 48.46,41.05 48.46,48.16 61.47,61.16 62.79,61.16 CH3.CENTER
  Bottom 0.305: v46.43,30.89 46.43,29.87 U$1.59 | v48.16,40.64 SEC_CH3.3
N$29  (via drill 0.61)
  Top 0.305: v45.62,27.94 45.62,28.75 49.48,32.61 v49.48,40.44 49.89,40.74 50.6,41.45 v55.37,41.45
  Bottom 0.305: v45.62,27.94 45.62,28.85 U$1.58 | v49.48,40.44 50.29,40.44 SEC_CH4.3 | v55.37,41.45 75.08,61.16 89.51,61.16 CH4.CENTER
N$30  (via drill 0.61)
  Top 0.305: v21.03,23.57 20.12,24.49 v20.12,45.11
  Bottom 0.305: v21.03,23.57 21.84,22.76 21.84,21.03 20.73,19.91 19.51,19.91 USART_IN.4 | v20.12,45.11 20.12,52.22 19.81,52.53 19.81,55.88 21.03,57.1 25.09,57.1 26.01,56.19 PORT.6
N$32  (via drill 0.61)
  Top 0.305: v21.03,24.89 21.03,46.53 26.42,51.92 26.42,52.63 PORT.5
  Bottom 0.305: v21.03,24.89 19.91,23.77 19.51,23.77 USART_IN.7
N$34  (via drill 0.61)
  Top 0.305: v13.92,22.15 13.92,31.6 v11.58,33.93 | v8.94,47.95 15.65,54.66 27.64,54.66 28.55,55.58 PORT.8
  Bottom 0.305: v13.92,22.15 17.37,18.69 17.58,18.69 USART_IN.3 | v11.58,33.93 11.58,35.87 10.57,36.88 9.65,36.88 8.94,37.59 v8.94,47.95
N$35  (via drill 0.61)
  Top 0.305: v22.35,24.89 22.35,46.02 28.96,52.63 PORT.7
  Bottom 0.305: v22.35,24.89 23.67,24.89 USART_IN.9
N$36  (via drill 0.61)
  Top 0.305: v45.11,30.89 v46.94,32.72
  Bottom 0.305: v45.11,30.89 43.99,30.89 43.28,30.18 43.28,29.87 U$1.55 | v46.94,32.72 46.94,33.53 5V_ADC_H.2 47.85,35.05 48.36,35.56 50.09,35.56 50.6,35.05 51.82,35.05 5V_ADC_L.1
N$37  (via drill 0.61)
  Top 0.305: v8.64,61.27 8.64,66.75 LED_CH1.A
  Bottom 0.305: v8.64,61.27 12.39,57.51 12.39,41.15 18.59,34.95 18.8,34.95 29.36,24.38 36.17,24.38 U$1.44
N$38  (via drill 0.61)
  Top 0.305: v27.23,37.8 27.23,41.96 38,52.73 38,56.49 35.66,58.83 35.66,66.75 LED_CH2.A
  Bottom 0.305: v27.23,37.8 27.23,33.33 35.36,25.2 36.17,25.2 U$1.45
N$39  (via drill 0.61)
  Top 0.305: v28.14,33.73 28.14,41.45 v40.03,53.34 | v61.57,65.94 62.38,66.75 LED_CH3.A
  Bottom 0.305: v28.14,33.73 35.87,26.01 36.17,26.01 U$1.46 | v40.03,53.34 48.97,53.34 v61.57,65.94
N$40  (via drill 0.61)
  Top 0.305: v41.86,22.66 49.68,22.66 52.02,24.99 54.05,24.99 67.16,38.1 67.16,38.71 73.97,45.52 87.07,45.52 89.2,47.65 89.2,52.12 88.39,52.93 88.39,66.55 88.59,66.75 LED_CH4.A
  Bottom 0.305: v41.86,22.66 37.9,26.62 37.19,26.62 U$1.47
N$41  (via drill 0.61)
  Top 0.305: v39.73,71.02 14.43,71.02 11.79,68.38 11.79,67.87 LED_CH1.C
  Bottom 0.305: v39.73,71.02 42.88,71.02 48.56,65.33 LEDS.2
N$42
  Top 0.305: LED_CH2.C 38.41,67.87 38.41,68.38 41.05,71.02 44.81,71.02 48.26,67.56 LEDS.3
N$43
  Top 0.305: LED_CH3.C 64.01,67.87 63.8,67.87 60.66,71.02 51.71,71.02 50.8,70.1 LEDS.4
N$44
  Top 0.305: LED_CH4.C 90.63,67.87 90.42,67.87 86.06,72.24 50.8,72.24 LEDS.5
N$45
  Bottom 0.305: RS232C.1 35.15,3.25 38.61,3.25 C3.+
N$46
  Bottom 0.305: RS232C.3 32.61,4.27 33.93,5.59 38.61,5.59 C3.-
N$47
  Bottom 0.305: RS232C.4 30.89,2.34 30.68,2.13 30.68,2.03 30.48,1.83 22.55,1.83 22.35,2.03 C4.+
N$48
  Bottom 0.305: RS232C.5 29.57,4.27 29.36,4.47 29.36,4.57 28.35,5.59 22.35,5.59 C4.-
N$49
  Bottom 0.305: RS232C.2 33.93,2.34 34.14,2.13 34.14,2.03 34.65,1.52 44.5,1.52 45.01,2.03 C7.+
N$50  (via drill 0.61)
  Top 0.305: v16.87,4.67 v23.16,4.67
  Bottom 0.305: v23.16,4.67 23.27,4.78 27.84,4.78 28.35,4.27 RS232C.6 | v16.87,4.67 15.95,5.59 C8.-
N$51
  Bottom 0.305: PRE_Q2.2 61.67,9.25 64.31,9.25 Q2.1 65.63,8.74 66.95,7.42 66.95,4.37 HIGHPASS_BL.1
N$54  (via drill 0.61)
  Top 0.305: v42.77,23.57 33.43,23.57 31.7,21.84 v26.52,21.84
  Bottom 0.305: v42.77,23.57 44.3,25.09 51.71,25.09 U$1.4 | v26.52,21.84 25.6,20.93 USART_IN.12
PWM_FOR_BG
  Bottom 0.305: U$1.17 50.29,13.31 50.29,10.06 48.87,8.64 48.87,4.98 51.61,2.23 60.45,2.23 61.67,3.45 HIGHPASS_BL.2
RESET_5V  (via drill 0.61)
  Top 0.305: v59.84,15.04 v64.52,19.71
  Bottom 0.305: v59.84,15.04 58.32,16.56 52.73,16.56 U$1.15 | v64.52,19.71 64.52,20.93 66.85,23.27 LEVEL_SHIFT.9
RS_5V  (via drill 0.61)
  Top 0.305: v57.91,15.65 59.13,15.65 64.11,20.62 v66.04,20.62
  Bottom 0.305: v57.91,15.65 52.73,15.65 U$1.16 | v66.04,20.62 66.75,20.62 66.85,20.73 LEVEL_SHIFT.11
SDATA_5V  (via drill 0.61)
  Top 0.305: v59.23,18.59 v59.23,20.52
  Bottom 0.305: v59.23,18.59 56.49,18.59 56.29,18.8 52.73,18.8 U$1.12 | v59.23,20.52 60.76,22.05 LEVEL_SHIFT.7
SWITCH_ON  (via drill 0.61)
  Top 0.305: v42.88,25.81 47.45,25.81 71.12,49.48 v71.12,54.66
  Bottom 0.305: v42.88,25.81 40.13,28.55 40.13,28.85 U$1.51 | v71.12,54.66 75.39,58.93 77.22,58.93 R8.1
TRIGGER_SRC  (via drill 0.61)
  Top 0.305: v27.33,22.86 v31.39,22.86
  Bottom 0.305: v31.39,22.86 36.17,22.86 U$1.42 | v27.33,22.86 26.11,22.86 25.6,23.37 USART_IN.10
USART0_RXD  (via drill 0.61)
  Top 0.305: v30.89,7.62 30.89,9.45 27.33,13.01 26.82,13.01 19,20.83 v19,35.87
  Bottom 0.305: v30.89,7.62 30.89,8.43 RS232C.13 | v19,35.87 16.66,38.2 16.66,54.36 20.83,58.52 33.43,58.52 35.66,56.29 35.66,54.97 36.58,54.05 PORT.13
USART0_TXD  (via drill 0.61)
  Top 0.305: v32.11,12.39 v32.11,15.75 | v29.97,15.75 29.97,16.26 24.18,22.05 24.18,43.99 33.12,52.93 33.12,53.95 33.83,54.66 35.26,54.66 36.17,55.58 PORT.14
  Bottom 0.305: v32.11,12.39 32.11,10.36 RS232C.14 | v32.11,15.75 v29.97,15.75
USART0_XCK_IN  (via drill 0.61)
  Top 0.305: v22.86,23.27 22.86,24.08 23.27,24.49 v23.27,40.54 | v25.09,42.37 25.09,43.69 34.04,52.63 PORT.11
  Bottom 0.305: v22.86,23.27 23.67,22.45 USART_IN.11 | v23.27,40.54 v25.09,42.37
VCC  (via drill 0.61)
  Top 0.305: C2.1 75.18,62.89 75.18,55.68 75.59,55.27 75.59,53.54 74.78,52.73 LM1086-5.0.2 | v12.29,38.61 23.88,50.19 23.88,52.63 PORT.3 | v51.61,39.32 v55.27,39.32
  Bottom 0.305: L1.1 92.15,28.85 91.03,27.74 73.25,27.74 3V_1.A 72.34,29.06 72.34,38.41 71.73,39.01 71.73,39.32 | 71.73,39.32 71.73,50.19 72.54,51 72.54,51.41 LM1086-5.0.2 | 51.61,39.52 52.53,39.52 SEC_CH4.2 | 51.61,39.52 47.45,39.52 SEC_CH3.2 | 44.81,31.8 47.35,31.8 48.67,33.12 | 44.81,31.8 42.16,31.8 40.95,30.58 40.95,29.87 U$1.52 | 48.67,33.12 49.07,33.53 5V_ADC_H.1 | 48.77,31.6 48.77,33.02 48.67,33.12 | 48.77,31.6 48.77,29.87 U$1.62 | U$1.64 50.29,29.87 50.29,30.18 48.87,31.6 48.77,31.6 | SEC_CH3.2 46.13,39.22 46.13,33.22 44.81,31.9 44.81,31.8 | PORT.3 24.38,52.63 24.38,47.65 29.97,42.06 SEC_CH1.2 31.29,41.55 36.37,41.55 SEC_CH2.2 37.69,41.55 40.13,41.55 41.96,39.73 46.13,39.73 SEC_CH3.2 | U$1.21 47.14,13.31 47.14,12.8 46.53,12.19 R3.1 46.02,10.67 46.02,8.13 C7.- 45.01,8.13 44.5,8.64 35.15,8.64 RS232C.16 34.65,8.43 34.44,8.23 34.44,8.13 33.02,6.71 26.72,6.71 17.78,15.65 USART_IN.1 17.58,16.05 15.14,18.49 10.46,18.49 R2.2 9.96,20.02 9.96,32.31 JP1.2 11.99,33.02 12.5,33.53 12.5,34.34 12.29,34.54 v12.29,38.61 | v55.27,39.32 71.73,39.32 | 51.61,39.52 v51.61,39.32
XCK_5V  (via drill 0.61)
  Top 0.305: v5.08,30.89 5.08,19.2 6.2,18.09 7.21,18.09 9.96,15.34 9.96,8.33 11.58,6.71 35.26,6.71 43.79,15.24 43.79,15.65 46.33,18.19 55.58,18.19 v56.9,19.51
  Bottom 0.305: 56.9,19.61 60.76,19.61 LEVEL_SHIFT.5 | 56.9,19.61 52.73,19.61 U$1.11 | v5.08,30.89 6.2,32 6.2,33.73 7.32,34.85 JP1.3 | v56.9,19.51 56.9,19.61
(copper drawn outside any net)
  shapes: Bottom area x1

### Text on the board
Top: Top Layer
Bottom: Bottom Layer
tNames: Sketchy - Sven Kreiss - Mar 2006 | Version 1.0
bNames: Sketchy - Sven Kreiss - Mar 2006